# Altium project Arm.PrjPcb (part 2 of 2)
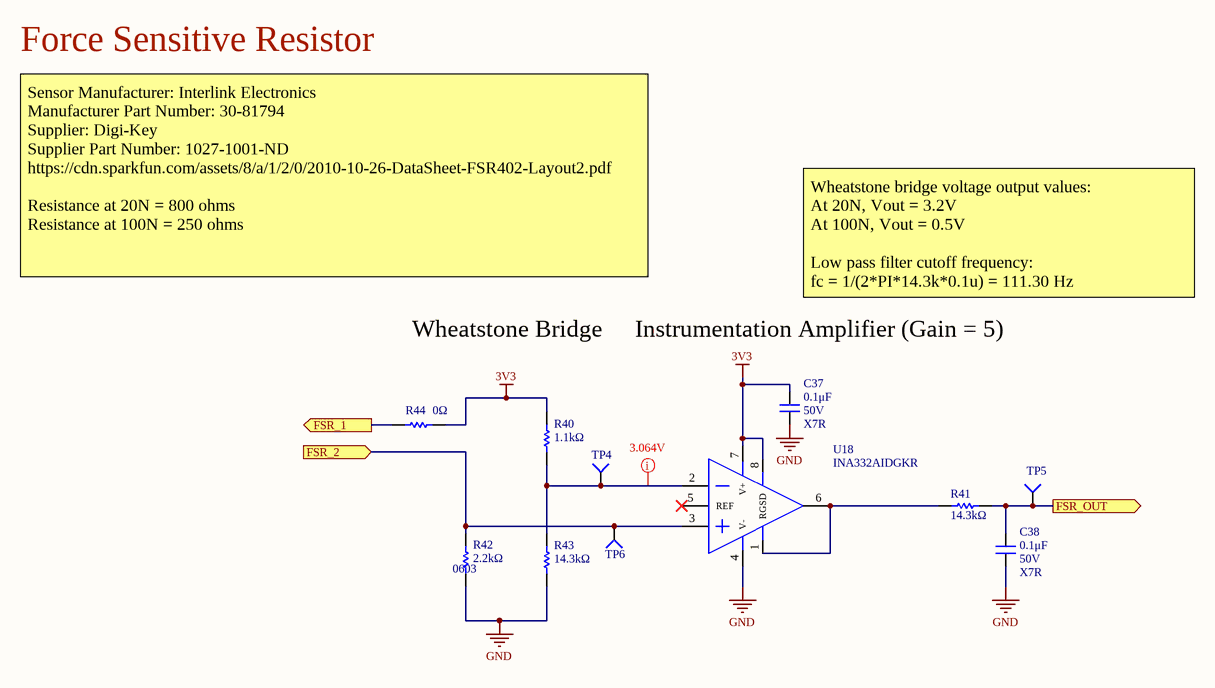
[diagram p8: SH8 - FORCE SENSITIVE RESISTOR.SchDoc]

## Nets that join several sheets
3V3: SH1 - POWER (C2.2 R1.2 TP2.1 U1.5), SH2 - CONNECTORS_1 (6 pins), SH3 - CONNECTORS_2 (R20.2 R21.2 R22.2 R25.2), SH5 - NETZER ENCODERS (25 pins), SH6 - MICROCONTROLLER (21 pins), SH7 - CAN (C17.1 C18.1 U3.3 U4.3), SH8 - FORCE SENSITIVE RESISTOR (5 pins)
5V_FUSED: SH1 - POWER (6 pins), SH2 - CONNECTORS_1 (F2.2 F3.2 F4.2), SH3 - CONNECTORS_2 (F5.2 F6.2 F7.2 F8.2), SH4 - LEVEL SHIFTERS (16 pins)
GND: SH1 - POWER (7 pins), SH2 - CONNECTORS_1 (30 pins), SH3 - CONNECTORS_2 (37 pins), SH4 - LEVEL SHIFTERS (16 pins), SH5 - NETZER ENCODERS (22 pins), SH6 - MICROCONTROLLER (25 pins), SH7 - CAN (11 pins), SH8 - FORCE SENSITIVE RESISTOR (5 pins)
BISS_ELBW_CLK_N: SH2 - CONNECTORS_1 (J2.23), SH5 - NETZER ENCODERS (U14.10)
BISS_ELBW_CLK_P: SH2 - CONNECTORS_1 (J2.24), SH5 - NETZER ENCODERS (U14.9)
BISS_ELBW_DATA_N: SH2 - CONNECTORS_1 (J2.21), SH5 - NETZER ENCODERS (R36.1 U14.11)
BISS_ELBW_DATA_P: SH2 - CONNECTORS_1 (J2.20), SH5 - NETZER ENCODERS (R36.2 U14.12)
BISS_SHLDR_CLK_N: SH2 - CONNECTORS_1 (J3.23), SH5 - NETZER ENCODERS (U13.10)
BISS_SHLDR_CLK_P: SH2 - CONNECTORS_1 (J3.24), SH5 - NETZER ENCODERS (U13.9)
BISS_SHLDR_DATA_N: SH2 - CONNECTORS_1 (J3.21), SH5 - NETZER ENCODERS (R35.1 U13.11)
BISS_SHLDR_DATA_P: SH2 - CONNECTORS_1 (J3.20), SH5 - NETZER ENCODERS (R35.2 U13.12)
BISS_TRNTBL_CLK_N: SH2 - CONNECTORS_1 (J4.23), SH5 - NETZER ENCODERS (U16.10)
BISS_TRNTBL_CLK_P: SH2 - CONNECTORS_1 (J4.24), SH5 - NETZER ENCODERS (U16.9)
BISS_TRNTBL_DATA_N: SH2 - CONNECTORS_1 (J4.21), SH5 - NETZER ENCODERS (R38.1 U16.11)
BISS_TRNTBL_DATA_P: SH2 - CONNECTORS_1 (J4.20), SH5 - NETZER ENCODERS (R38.2 U16.12)
BISS_WRSTL_CLK_N: SH3 - CONNECTORS_2 (J7.23), SH5 - NETZER ENCODERS (U15.10)
BISS_WRSTL_CLK_P: SH3 - CONNECTORS_2 (J7.24), SH5 - NETZER ENCODERS (U15.9)
BISS_WRSTL_DATA_N: SH3 - CONNECTORS_2 (J7.21), SH5 - NETZER ENCODERS (R37.1 U15.11)
BISS_WRSTL_DATA_P: SH3 - CONNECTORS_2 (J7.20), SH5 - NETZER ENCODERS (R37.2 U15.12)
BISS_WRSTR_CLK_N: SH3 - CONNECTORS_2 (J9.23), SH5 - NETZER ENCODERS (U17.10)
BISS_WRSTR_CLK_P: SH3 - CONNECTORS_2 (J9.24), SH5 - NETZER ENCODERS (U17.9)
BISS_WRSTR_DATA_N: SH3 - CONNECTORS_2 (J9.21), SH5 - NETZER ENCODERS (R39.1 U17.11)
BISS_WRSTR_DATA_P: SH3 - CONNECTORS_2 (J9.20), SH5 - NETZER ENCODERS (R39.2 U17.12)
NetC38_2: SH6 - MICROCONTROLLER (U2.16), SH8 - FORCE SENSITIVE RESISTOR (C38.2 R41.2 TP5.1)
NetJ2_6: SH2 - CONNECTORS_1 (J2.6 J3.6 J4.6), SH3 - CONNECTORS_2 (J7.6 J8.11 J9.6), SH4 - LEVEL SHIFTERS (R28.2)
NetJ2_7: SH2 - CONNECTORS_1 (J2.7), SH6 - MICROCONTROLLER (U2.92)
NetJ2_8: SH2 - CONNECTORS_1 (J2.8 J3.8 J4.8), SH3 - CONNECTORS_2 (J7.8 J8.12 J9.8), SH6 - MICROCONTROLLER (U2.4)
NetJ2_10: SH2 - CONNECTORS_1 (J2.10), SH4 - LEVEL SHIFTERS (R29.2), SH5 - NETZER ENCODERS (U14.5)
NetJ2_12: SH2 - CONNECTORS_1 (J2.12), SH5 - NETZER ENCODERS (U14.2), SH6 - MICROCONTROLLER (U2.31)
NetJ2_15: SH2 - CONNECTORS_1 (J2.15 R2.1), SH6 - MICROCONTROLLER (U2.67)
NetJ2_16: SH2 - CONNECTORS_1 (J2.16 R3.1), SH6 - MICROCONTROLLER (U2.66)
NetJ2_17: SH2 - CONNECTORS_1 (J2.17 R4.2), SH6 - MICROCONTROLLER (U2.62)
NetJ2_18: SH2 - CONNECTORS_1 (J2.18), SH6 - MICROCONTROLLER (U2.58)
NetJ3_7: SH2 - CONNECTORS_1 (J3.7), SH6 - MICROCONTROLLER (U2.5)
NetJ3_10: SH2 - CONNECTORS_1 (J3.10), SH3 - CONNECTORS_2 (J7.10 J9.10), SH4 - LEVEL SHIFTERS (R27.2), SH5 - NETZER ENCODERS (U13.5 U15.5 U17.5)
NetJ3_12: SH2 - CONNECTORS_1 (J3.12), SH3 - CONNECTORS_2 (J7.12 J9.12), SH5 - NETZER ENCODERS (U13.2 U15.2 U17.2), SH6 - MICROCONTROLLER (U2.79)
NetJ3_15: SH2 - CONNECTORS_1 (J3.15 R6.1), SH6 - MICROCONTROLLER (U2.87)
NetJ3_16: SH2 - CONNECTORS_1 (J3.16 R5.1), SH6 - MICROCONTROLLER (U2.86)
NetJ3_17: SH2 - CONNECTORS_1 (J3.17 R9.2), SH6 - MICROCONTROLLER (U2.60)
NetJ3_18: SH2 - CONNECTORS_1 (J3.18), SH6 - MICROCONTROLLER (U2.56)
NetJ4_7: SH2 - CONNECTORS_1 (J4.7), SH6 - MICROCONTROLLER (U2.36)
NetJ4_10: SH2 - CONNECTORS_1 (J4.10), SH4 - LEVEL SHIFTERS (R31.2), SH5 - NETZER ENCODERS (U16.5)
NetJ4_12: SH2 - CONNECTORS_1 (J4.12), SH5 - NETZER ENCODERS (U16.2), SH6 - MICROCONTROLLER (U2.17)
NetJ4_15: SH2 - CONNECTORS_1 (J4.15 R8.1), SH6 - MICROCONTROLLER (U2.30)
NetJ4_16: SH2 - CONNECTORS_1 (J4.16 R7.1), SH6 - MICROCONTROLLER (U2.29)
NetJ4_17: SH2 - CONNECTORS_1 (J4.17 R10.2), SH6 - MICROCONTROLLER (U2.95)
NetJ4_18: SH2 - CONNECTORS_1 (J4.18), SH6 - MICROCONTROLLER (U2.26)
NetJ7_7: SH3 - CONNECTORS_2 (J7.7), SH6 - MICROCONTROLLER (U2.7)
NetJ7_17: SH3 - CONNECTORS_2 (J7.17 R24.2), SH6 - MICROCONTROLLER (U2.61)
NetJ8_4: SH3 - CONNECTORS_2 (J8.4), SH6 - MICROCONTROLLER (U2.3)
NetJ8_7: SH3 - CONNECTORS_2 (J8.7), SH6 - MICROCONTROLLER (U2.2)
NetJ8_8: SH3 - CONNECTORS_2 (J8.8 R20.1), SH6 - MICROCONTROLLER (U2.1)
NetJ8_16: SH3 - CONNECTORS_2 (J8.16), SH4 - LEVEL SHIFTERS (R32.2)
NetJ8_20: SH3 - CONNECTORS_2 (J8.20 R23.2), SH6 - MICROCONTROLLER (U2.59)
NetJ8_23: SH3 - CONNECTORS_2 (J8.23), SH8 - FORCE SENSITIVE RESISTOR (R42.2 TP6.1 U18.3)
NetJ8_24: SH3 - CONNECTORS_2 (J8.24), SH8 - FORCE SENSITIVE RESISTOR (R44.2)
NetJ9_7: SH3 - CONNECTORS_2 (J9.7), SH6 - MICROCONTROLLER (U2.8)
NetJ9_16: SH3 - CONNECTORS_2 (J9.16 R25.1), SH6 - MICROCONTROLLER (U2.97)
NetJ9_17: SH3 - CONNECTORS_2 (J9.17 R26.2), SH6 - MICROCONTROLLER (U2.96)
NetJ9_18: SH3 - CONNECTORS_2 (J9.18), SH6 - MICROCONTROLLER (U2.98)
NetJ10_1: SH3 - CONNECTORS_2 (J10.1), SH6 - MICROCONTROLLER (U2.24)
NetJ10_2: SH3 - CONNECTORS_2 (J10.2), SH6 - MICROCONTROLLER (U2.23)
NetJ10_3: SH3 - CONNECTORS_2 (J10.3), SH6 - MICROCONTROLLER (U2.42)
NetJ10_4: SH3 - CONNECTORS_2 (J10.4), SH6 - MICROCONTROLLER (U2.40)
NetJ10_5: SH3 - CONNECTORS_2 (J10.5), SH6 - MICROCONTROLLER (U2.64)
NetJ10_6: SH3 - CONNECTORS_2 (J10.6), SH6 - MICROCONTROLLER (U2.90)
NetR30_2: SH4 - LEVEL SHIFTERS (R30.2), SH5 - NETZER ENCODERS (U13.3)
NetR33_2: SH4 - LEVEL SHIFTERS (R33.2), SH5 - NETZER ENCODERS (U15.3)
NetR34_2: SH4 - LEVEL SHIFTERS (R34.2), SH5 - NETZER ENCODERS (U17.3)
NetU2_32: SH4 - LEVEL SHIFTERS (U10.2), SH6 - MICROCONTROLLER (U2.32)
NetU2_43: SH4 - LEVEL SHIFTERS (U6.2), SH6 - MICROCONTROLLER (U2.43)
NetU2_47: SH4 - LEVEL SHIFTERS (U9.2), SH6 - MICROCONTROLLER (U2.47)
NetU2_51: SH6 - MICROCONTROLLER (U2.51), SH7 - CAN (U4.4)
NetU2_52: SH6 - MICROCONTROLLER (U2.52), SH7 - CAN (U4.1)
NetU2_70: SH6 - MICROCONTROLLER (U2.70), SH7 - CAN (U3.4)
NetU2_71: SH6 - MICROCONTROLLER (U2.71), SH7 - CAN (U3.1)
NetU2_78: SH4 - LEVEL SHIFTERS (U5.2), SH6 - MICROCONTROLLER (U2.78)
NetU2_80: SH4 - LEVEL SHIFTERS (U12.2), SH6 - MICROCONTROLLER (U2.80)
NetU2_81: SH4 - LEVEL SHIFTERS (U8.2), SH6 - MICROCONTROLLER (U2.81)
NetU2_82: SH4 - LEVEL SHIFTERS (U11.2), SH6 - MICROCONTROLLER (U2.82)
NetU2_89: SH4 - LEVEL SHIFTERS (U7.2), SH6 - MICROCONTROLLER (U2.89)